# EAGLE design quadcopter_2 (EAGLE 8.1.1)
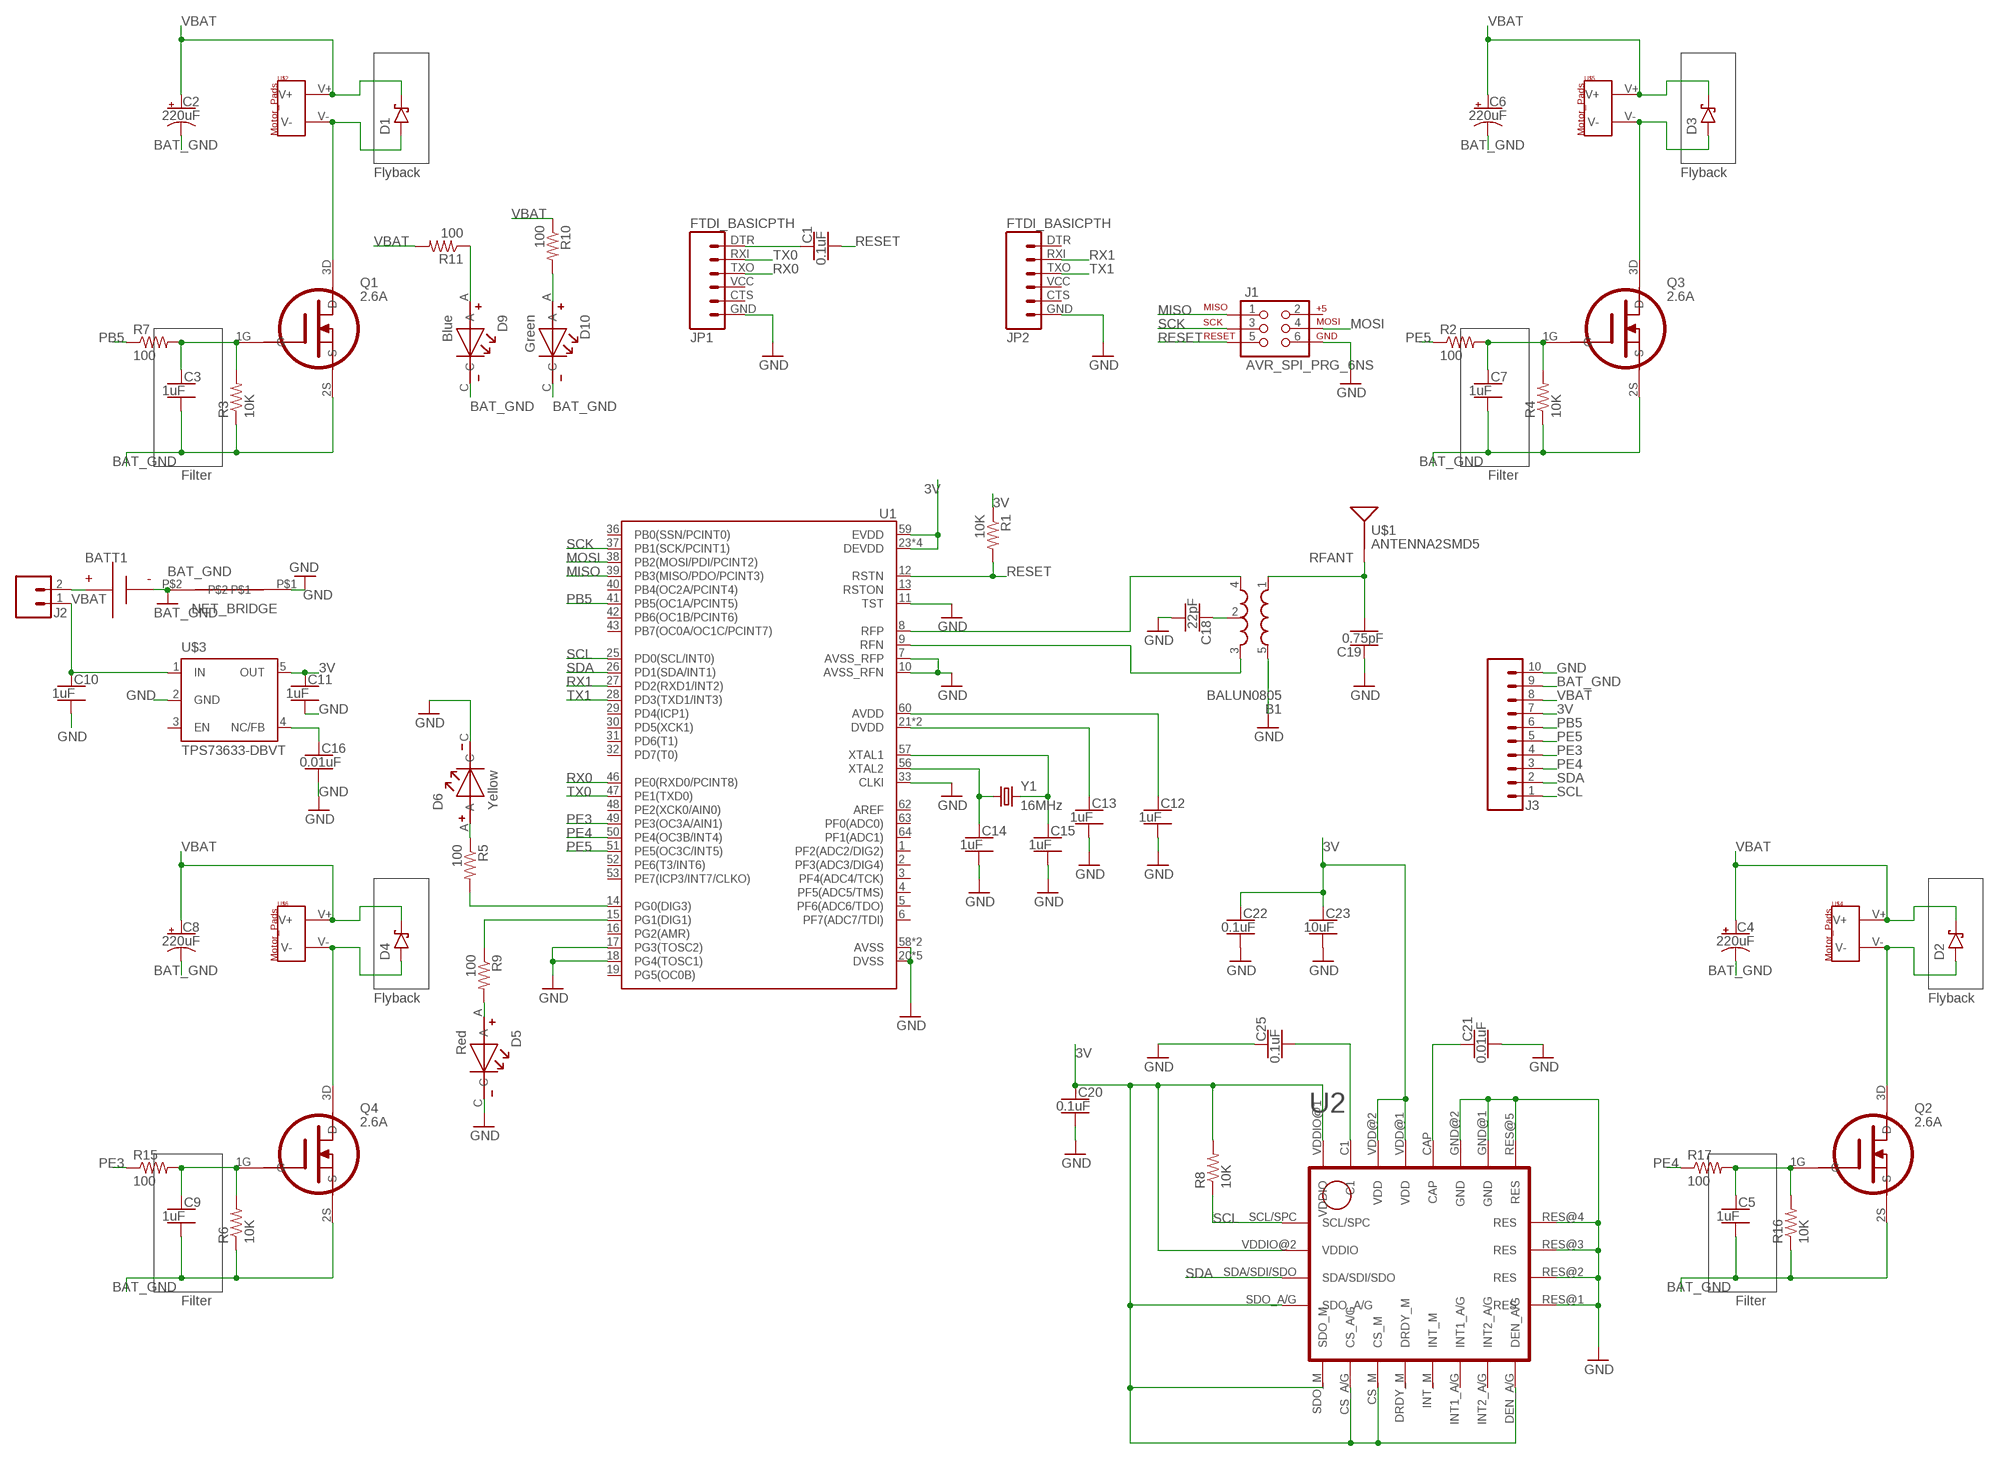
[diagram p0: schematic, sheet 1]

## Parts
B1  BALUN0805  [BALUN]
BATT1  BATTERY-HUBSAN-W/HOLDER  [BATTERY-W/HOLDER-380MAH-HUBSAN]
C1  0.1uF  CERAMIC_CAP-0805-0.1UF  [CERAMIC_CAP_0805]
C2  220uF  CAPACITOR-POL_SMD-7043-D_TANTALUM-220UF  [CAPMP7343X310_HS]
C3  1uF  CAPACITOR-NP_SMD-2012-0805_CERAMIC-1UF  [CAPC2012X140_HS]
C4  220uF  CAPACITOR-POL_SMD-7043-D_TANTALUM-220UF  [CAPMP7343X310_HS]
C5  1uF  CAPACITOR-NP_SMD-2012-0805_CERAMIC-1UF  [CAPC2012X140_HS]
C6  220uF  CAPACITOR-POL_SMD-7043-D_TANTALUM-220UF  [CAPMP7343X310_HS]
C7  1uF  CAPACITOR-NP_SMD-2012-0805_CERAMIC-1UF  [CAPC2012X140_HS]
C8  220uF  CAPACITOR-POL_SMD-7043-D_TANTALUM-220UF  [CAPMP7343X310_HS]
C9  1uF  CAPACITOR-NP_SMD-2012-0805_CERAMIC-1UF  [CAPC2012X140_HS]
C10  1uF  CAPACITOR-NP_SMD-2012-0805_CERAMIC-1UF  [CAPC2012X140_HS]
C11  1uF  CAPACITOR-NP_SMD-2012-0805_CERAMIC-1UF  [CAPC2012X140_HS]
C12  1uF  CAPACITOR-NP_SMD-2012-0805_CERAMIC-1UF  [CAPC2012X140_HS]
C13  1uF  CAPACITOR-NP_SMD-2012-0805_CERAMIC-1UF  [CAPC2012X140_HS]
C14  1uF  CAPACITOR-NP_SMD-2012-0805_CERAMIC-1UF  [CAPC2012X140_HS]
C15  1uF  CAPACITOR-NP_SMD-2012-0805_CERAMIC-1UF  [CAPC2012X140_HS]
C16  0.01uF  CAPACITOR-NP_SMD-2012-0805_CERAMIC-0.01UF  [CAPC2012X140_HS]
C18  22pF  CAPACITOR-NP_SMD-2012-0805_CERAMIC-22PF  [CAPC2012X140_HS]
C19  0.75pF  CAPACITOR-NP_SMD-2012-0805_CERAMIC-0.75PF  [CAPC2012X140_HS]
C20  0.1uF  CAPACITOR-NP_SMD-2012-0805_CERAMIC-0.1UF  [CAPC2012X140_HS]
C21  0.01uF  CAPACITOR-NP_SMD-2012-0805_CERAMIC-0.01UF  [CAPC2012X140_HS]
C22  0.1uF  CAPACITOR-NP_SMD-2012-0805_CERAMIC-0.1UF  [CAPC2012X140_HS]
C23  10uF  CAPACITOR-NP_SMD-2012-0805_CERAMIC-10UF  [CAPC2012X140_HS]
C25  0.1uF  CAPACITOR-NP_SMD-2012-0805_CERAMIC-0.1UF  [CAPC2012X140_HS]
D1  DIODE-SCHOTTKY_SMD-SOD123  [SOD3716X135_HS]
D2  DIODE-SCHOTTKY_SMD-SOD123  [SOD3716X135_HS]
D3  DIODE-SCHOTTKY_SMD-SOD123  [SOD3716X135_HS]
D4  DIODE-SCHOTTKY_SMD-SOD123  [SOD3716X135_HS]
D5  Red  LED_VLMX51Z1AARED  [LED_VLMX51Z1AA]
D6  Yellow  LED_VLMX51Z1AAYELLOW  [LED_VLMX51Z1AA]
D9  Blue  LED_OVS5MXBCR4BLUE  [LED_OVS5MXBCR4]
D10  Green  LED_OVS5MXBCR4GREEN  [LED_OVS5MXBCR4]
J1  AVR_SPI_PRG_6NS  [2X3-NS]
J2  MALE_HEADER_2POS-2X1-0.1IN  [MALE_HEADER_2X1_0.1IN]
J3  SIP-10_TH-254X10  [HDRV10W63P254_10X1_2540X254H838_HS]
JP1  FTDI_BASICPTH  [FTDI_BASIC]
JP2  FTDI_BASICPTH  [FTDI_BASIC]
NET_BRIDGE  NET_BRIDGE  [NET_BRIDGE]
Q1  2.6A  N_MOSFET_SI2302CDS_T1_E3  [N_MOSFET_SI2302CDS_T1_E3]
Q2  2.6A  N_MOSFET_SI2302CDS_T1_E3  [N_MOSFET_SI2302CDS_T1_E3]
Q3  2.6A  N_MOSFET_SI2302CDS_T1_E3  [N_MOSFET_SI2302CDS_T1_E3]
Q4  2.6A  N_MOSFET_SI2302CDS_T1_E3  [N_MOSFET_SI2302CDS_T1_E3]
R1  10K  RESISTOR_SMD-2012-0805-10K  [RESC2012X60_HS]
R2  100  RESISTOR_SMD-2012-0805-100  [RESC2012X60_HS]
R3  10K  RESISTOR_SMD-2012-0805-10K  [RESC2012X60_HS]
R4  10K  RESISTOR_SMD-2012-0805-10K  [RESC2012X60_HS]
R5  100  RESISTOR_SMD-2012-0805-100  [RESC2012X60_HS]
R6  10K  RESISTOR_SMD-2012-0805-10K  [RESC2012X60_HS]
R7  100  RESISTOR_SMD-2012-0805-100  [RESC2012X60_HS]
R8  10K  RESISTOR_SMD-2012-0805-10K  [RESC2012X60_HS]
R9  100  RESISTOR_SMD-2012-0805-100  [RESC2012X60_HS]
R10  100  RESISTOR_SMD-2012-0805-100  [RESC2012X60_HS]
R11  100  RESISTOR_SMD-2012-0805-100  [RESC2012X60_HS]
R15  100  RESISTOR_SMD-2012-0805-100  [RESC2012X60_HS]
R16  10K  RESISTOR_SMD-2012-0805-10K  [RESC2012X60_HS]
R17  100  RESISTOR_SMD-2012-0805-100  [RESC2012X60_HS]
U1  ATMEGA128RFA1  [QFN-64]
U2  IMU_LSM9DS1TR  [IMU_LSM9DS1TR]
U$1  ANTENNA2SMD5  [ANTENNA-CHIP5]
U$2  MOTOR_PADS  [MOTOR_PADS]
U$3  TPS73633-DBVT  [SOT23-DBV]
U$4  MOTOR_PADS  [MOTOR_PADS]
U$5  MOTOR_PADS  [MOTOR_PADS]
U$6  MOTOR_PADS  [MOTOR_PADS]
Y1  16MHz  CRYSTAL5X3  [CRYSTAL-SMD-5X3]

## Nets
3V: C11.1 C20.1 C22.1 C23.1 J3.7 R1.1 R8.2 U1.23(DEVDD) U1.34(DEVDD) U1.44(DEVDD) U1.54(DEVDD) U1.59(EVDD) U2.CS_A/G U2.CS_M U2.DEN_A/G U2.SDO_A/G U2.SDO_M U2.VDD@1(VDD) U2.VDD@2(VDD) U2.VDDIO@1(VDDIO) U2.VDDIO@2(VDDIO) U$3.5(OUT)
BAT_GND [HIGHCURRENT]: BATT1.-(N) C2.2(-) C3.2 C4.2(-) C5.2 C6.2(-) C7.2 C8.2(-) C9.2 D9.C D10.C J3.9 NET_BRIDGE.P$2 Q1.2S(S) Q2.2S(S) Q3.2S(S) Q4.2S(S) R3.1 R4.1 R6.1 R16.1
FILTERED [HIGHCURRENT]: C9.1 Q4.1G(G) R6.2 R15.2
GND: B1.5(GND) C10.2 C11.2 C12.2 C13.2 C14.2 C15.2 C16.2 C18.2 C19.1 C20.2 C21.2 C22.2 C23.2 C25.1 D5.C D6.C J1.6 J3.10 JP1.GND JP2.GND NET_BRIDGE.P$1 U1.7(AVSS_RFP) U1.10(AVSS_RFN) U1.11(TST) U1.17(PG3(TOSC2)) U1.18(PG4(TOSC1)) U1.20(DVSS) U1.24(DVSS) U1.33(CLKI) U1.35(DVSS) U1.45(DVSS) U1.55(DVSS) U1.58(AVSS) U1.61(AVSS) U2.GND@1(GND) U2.GND@2(GND) U2.RES@1(RES) U2.RES@2(RES) U2.RES@3(RES) U2.RES@4(RES) U2.RES@5(RES) U$3.2(GND)
MISO: U1.39(PB3(MISO/PDO/PCINT3))
MOSI: U1.38(PB2(MOSI/PDI/PCINT2))
N$1: C1.1 JP1.DTR
N$2: JP1.TXO
N$3: JP1.RXI
N$4: C1.2
N$5: C15.1 U1.57(XTAL1) Y1.3
N$6: JP2.RXI
N$7: JP2.TXO
N$8: J1.1
N$9: J1.4
N$10: C12.1 U1.60(AVDD)
N$11: J1.3
N$12: J1.5
N$13: C13.1 U1.21(DVDD) U1.22(DVDD)
N$14: C14.1 U1.56(XTAL2) Y1.1
N$15: C25.2 U2.C1
N$16 [HIGHCURRENT]: D1.A Q1.3D(D) U$2.V-
N$17: C21.1 U2.CAP
N$18: D10.A R10.2
N$19: D5.A R9.2
N$20: R5.2 U1.14(PG0(DIG3))
N$21: B1.4(OUT1) U1.8(RFP)
N$22: B1.3(OUT2) U1.9(RFN)
N$23: BATT1.+(P) J2.2
N$24 [HIGHCURRENT]: D3.A Q3.3D(D) U$5.V-
N$25: B1.2(GND) C18.1
N$26: R9.1 U1.15(PG1(DIG1))
N$27: D9.A R11.1
N$28: D6.A R5.1
N$29 [HIGHCURRENT]: D4.A Q4.3D(D) U$6.V-
N$30 [HIGHCURRENT]: D2.A Q2.3D(D) U$4.V-
N$31 [HIGHCURRENT]: C7.1 Q3.1G(G) R2.2 R4.2
N$32: C16.1 U$3.4(NC/FB)
N$33 [HIGHCURRENT]: C3.1 Q1.1G(G) R3.2 R7.2
N$34 [HIGHCURRENT]: C5.1 Q2.1G(G) R16.2 R17.2
PB5: J3.6 R7.1 U1.41(PB5(OC1A/PCINT5))
PE3: J3.4 R15.1 U1.49(PE3(OC3A/AIN1))
PE4: J3.3 R17.1 U1.50(PE4(OC3B/INT4))
PE5: J3.5 R2.1 U1.51(PE5(OC3C/INT5))
RESET: R1.2 U1.12(RSTN)
RFANT [RFSIG]: B1.1(IN) C19.2 U$1.FEED(SIGNAL)
RX0: U1.46(PE0(RXD0/PCINT8))
RX1: U1.27(PD2(RXD1/INT2))
SCK: U1.37(PB1(SCK/PCINT1))
SCL: J3.1 R8.1 U1.25(PD0(SCL/INT0)) U2.SCL/SPC
SDA: J3.2 U1.26(PD1(SDA/INT1)) U2.SDA/SDI/SDO
TX0: U1.47(PE1(TXD0))
TX1: U1.28(PD3(TXD1/INT3))
VBAT [HIGHCURRENT]: C2.1(+) C4.1(+) C6.1(+) C8.1(+) C10.1 D1.C D2.C D3.C D4.C J2.1 J3.8 R10.1 R11.2 U$2.V+ U$3.1(IN) U$4.V+ U$5.V+ U$6.V+
Unconnected: J1.2 JP1.CTS JP1.VCC JP2.CTS JP2.DTR JP2.VCC U1.1(PF2(ADC2/DIG2)) U1.2(PF3(ADC3/DIG4)) U1.3(PF4(ADC4/TCK)) U1.4(PF5(ADC5/TMS)) U1.5(PF6(ADC6/TDO)) U1.6(PF7(ADC7/TDI)) U1.13(RSTON) U1.16(PG2(AMR)) U1.19(PG5(OC0B)) U1.29(PD4(ICP1)) U1.30(PD5(XCK1)) U1.31(PD6(T1)) U1.32(PD7(T0)) U1.36(PB0(SSN/PCINT0)) U1.40(PB4(OC2A/PCINT4)) U1.42(PB6(OC1B/PCINT6)) U1.43(PB7(OC0A/OC1C/PCINT7)) U1.48(PE2(XCK0/AIN0)) U1.52(PE6(T3/INT6)) U1.53(PE7(ICP3/INT7/CLKO)) U1.62(AREF) U1.63(PF0(ADC0)) U1.64(PF1(ADC1)) U2.DRDY_M U2.INT1_A/G U2.INT2_A/G U2.INT_M U$3.3(EN)

## Notes on the sheet
- Flyback | Flyback
- Filter | Filter
- Flyback | Flyback
- Filter | Filter

## Library data of the parts
B1 = quadparts_prebuilt:BALUN: 0805 footprint balun- Ember 351/357; DATASHEET: http://katalog.we-online.de/pbs/datasheet/748421245.pdf; DIST: Digikey; DISTPN: 732-2230-6-ND; MFR: Wurth Electronics Inc; MPN: 748421245; PRICE: 2.63
BATT1 = quadparts_prebuilt:BATTERY; CREATOR: Swanson; DIST: AMAZON; DISTPN: http://www.amazon.com/dp/B00RROB6Q4?smid=AMNTPWSAB5H0S; MFR: HUBSAN; MPN: X4-H107C-8-in-1
C1 = quadparts_connie:CERAMIC_CAP: Nonpolarized capacitor; CREATOR: SWANSON; DIST: Digikey; DISTPN: 490-1666-1-ND; MFR: Murata Electronics North America; MPN: GRM21BR71H104KA01L
C2 C4 C6 C8 = quadparts_prebuilt:CAPACITOR-POL_: Polarized capacitor; DIST: Digikey; DISTPN: 478-8912-1-ND; MFR: AVX Corporation; MPN: TAJD227K006RNJ
C3 C5 C7 C9-C15 = quadparts_prebuilt:CAPACITOR-NP_: Nonpolarized capacitor; DIST: Digikey; DISTPN: 490-4736-1-ND; MFR: Murata Electronics North America; MPN: GRM21BR71H105KA12L
C16 C21 = quadparts_prebuilt:CAPACITOR-NP_: Nonpolarized capacitor; DIST: Digikey; DISTPN: 490-8295-1-ND; MFR: Murata Electronics North America; MPN: GRM2195C1H103FA01D
C18 = quadparts_prebuilt:CAPACITOR-NP_: Nonpolarized capacitor; DIST: Digikey; DISTPN: 490-5534-1-ND; MFR: Murata Electronics North America; MPN: GRM21A5C2E220JW01D
C19 = quadparts_prebuilt:CAPACITOR-NP_: Nonpolarized capacitor; DIST: Digikey; DISTPN: 490-3585-1-ND; MFR: Murata Electronics North America; MPN: GQM2195C2AR75CB01D
C20 C22 C25 = quadparts_prebuilt:CAPACITOR-NP_: Nonpolarized capacitor; DIST: Digikey; DISTPN: 490-1666-1-ND; MFR: Murata Electronics North America; MPN: GRM21BR71H104KA01L
C23 = quadparts_prebuilt:CAPACITOR-NP_: Nonpolarized capacitor; DIST: Digikey; DISTPN: 490-5523-1-ND; MFR: Murata Electronics North America; MPN: GRM21BR61E106KA73L
D1-D4 = quadparts_prebuilt:DIODE-SCHOTTKY_: Schottky diode
D5 = LEDs:LED_VLMX51Z1AA: 2.2V, 140mA test, 200mA max; CREATOR: Jason Shiuan; DIST: Digikey; DISTPN: VLMR51Z1AA-GS08CT-ND; MFR: Vishay; MPN: VLMR51Z1AA-GS08
D6 = LEDs:LED_VLMX51Z1AA: 2.2V, 140mA test, 200mA max; CREATOR: Jason Shiuan; DIST: Digikey; DISTPN: VLMY51Z1AA-GS08CT-ND; MFR: Vishay; MPN: VLMY51Z1AA-GS08
D9 = LEDs:LED_OVS5MXBCR4: 3.4V, 150mA test, 180mA max; CREATOR: Jason Shiuan; DIST: Digikey; DISTPN: 365-1544-1-ND; MFR: TT Electronics/Optek Technology; MPN: OVS5MBBCR4
D10 = LEDs:LED_OVS5MXBCR4: 3.4V, 150mA test, 180mA max; CREATOR: Jason Shiuan; DIST: Digikey; DISTPN: 365-1545-1-ND; MFR: TT Electronics/Optek Technology; MPN: OVS5MGBCR4
J1 = quadparts_prebuilt:AVR_SPI_PRG_6: AVR ISP 6 Pin This is the reduced ISP connector for AVR programming. Common on Arduino. This footprint will take up less PCB space and can be used with a 10-pin to 6-pin adapter such as SKU: BOB-08508; DATASHEET: http://portal.fciconnect.com/Comergent//fci/drawing/67996.pdf; DIST: Digikey; DISTPN: 609-3234-ND; MFR: Amphenol FCI; MPN: 67997-206HLF; PRICE: 0.31
J2 = quadparts_connie:MALE_HEADER_2POS: 2 pin single inline pin header, socket, or connector; CREATOR: SWANSON; DIST: Digikey; DISTPN: 3M9447-ND; MFR: 3M; MPN: 961102-6404-AR
J3 = quadparts_prebuilt:SIP-10_: 10 pin single inline pin header, socket, or connector; DATASHEET: http://portal.fciconnect.com/Comergent//fci/drawing/68000.pdf; DIST: Digikey; DISTPN: 609-3250-ND; MFR: Amphenol FCI; MPN: 68000-110HLF; PRICE: 0.55
JP1 JP2 = quadparts_prebuilt:FTDI_BASIC: FTDI Basic header with labels; DATASHEET: http://portal.fciconnect.com/Comergent//fci/drawing/68015.pdf; DIST: Digikey; DISTPN: 609-3327-ND; MFR: Amphenol FCI; MPN: 68016-406HLF; PRICE: 0.33
NET_BRIDGE = quadparts_jason:NET_BRIDGE; CREATPR: Jason Shiuan
Q1-Q4 = quadparts_connie:N_MOSFET_SI2302CDS_T1_E3; CREATOR: Connie Du; DIST: Digikey; DISTPN: SI2302CDS-T1-E3CT-ND; MFR: Vishay Siliconix; MPN: SI2302CDS-T1-E3
R1 R3 R4 R6 R8 R16 = quadparts_prebuilt:RESISTOR_: Resistor; DIST: Digikey; DISTPN: 311-10KARCT-ND; MFR: Yageo; MPN: RC0805JR-0710KL
R2 R5 R7 R9-R11 R15 R17 = quadparts_prebuilt:RESISTOR_: Resistor; DIST: Digikey; DISTPN: 311-100ARCT-ND; MFR: Yageo; MPN: RC0805JR-07100RL
U1 = quadparts_prebuilt:ATMEGA128RFA1: ATmega128RFA1 8-bit AVR Microcontroller with Low Power 2.4GHz Transceiver for ZigBee and IEEE 802.15.4; CREATOR: Swanson; DATASHEET: http://www.atmel.com/Images/Atmel-8266-MCU_Wireless-ATmega128RFA1_Datasheet.pdf; DIST: Digikey; DISTPN: ATMEGA128RFA1-ZUR00DKR-ND; MFR: Atmel; MPN: ATMEGA128RFA1-ZUR00; PRICE: 10.21
U2 = quadparts_connie:IMU_LSM9DS1TR; CREATOR: Connie Du; DIST: Digikey; DISTPN: 497-14946-1-ND; MFR: STMicroelectronics; MPN: LSM9DS1TR
U$1 = quadparts_prebuilt:ANTENNA2: Chip antenna Single endded antenna. Common with smaller chip antennas. CHIP4 package is the GPS Chip Antenna SKU: GPS-08418. CHIP5 package is 2.4GHz chip antenna SKU: WRL-00144.; DATASHEET: http://www.linxtechnologies.com/resources/data-guides/ant-xxx-chp-x.pdf; DIST: Digikey; DISTPN: ANT-2.45-CHPCT-ND; MFR: Linx Technologies Inc.; MPN: ANT-2.45-CHP-T; PRICE: 3.16
U$2 U$4-U$6 = quadparts_prebuilt:MOTOR_PADS; DIST: NA; DISTPN: NA; MFR: NA; MPN: NA
U$3 = quadparts_prebuilt:TPS73633-DBVT; DATASHEET: http://www.ti.com/lit/ds/symlink/lp3985.pdf; DIST: Digikey; DISTPN: LP3985IM5X-3.0/NOPBCT-ND; MFR: Texas Instruments; MPN: LP3985IM5X-3.0/NOPB; PRICE: 0.59
Y1 = quadparts_prebuilt:CRYSTAL: Various standard crystals. Proven footprints.; DATASHEET: http://www.abracon.com/Resonators/abm3b.pdf; DIST: Digikey; DISTPN: 535-9122-1-ND; MFR: Abracon LLC; MPN: ABM3B-16.000MHZ-B2-T; PRICE: 0.68; PROD_ID: XTAL-08218

## Net classes
1 RFSIG: width 0.457 mm
2 HIGHCURRENT: width 0.457 mm

## Board
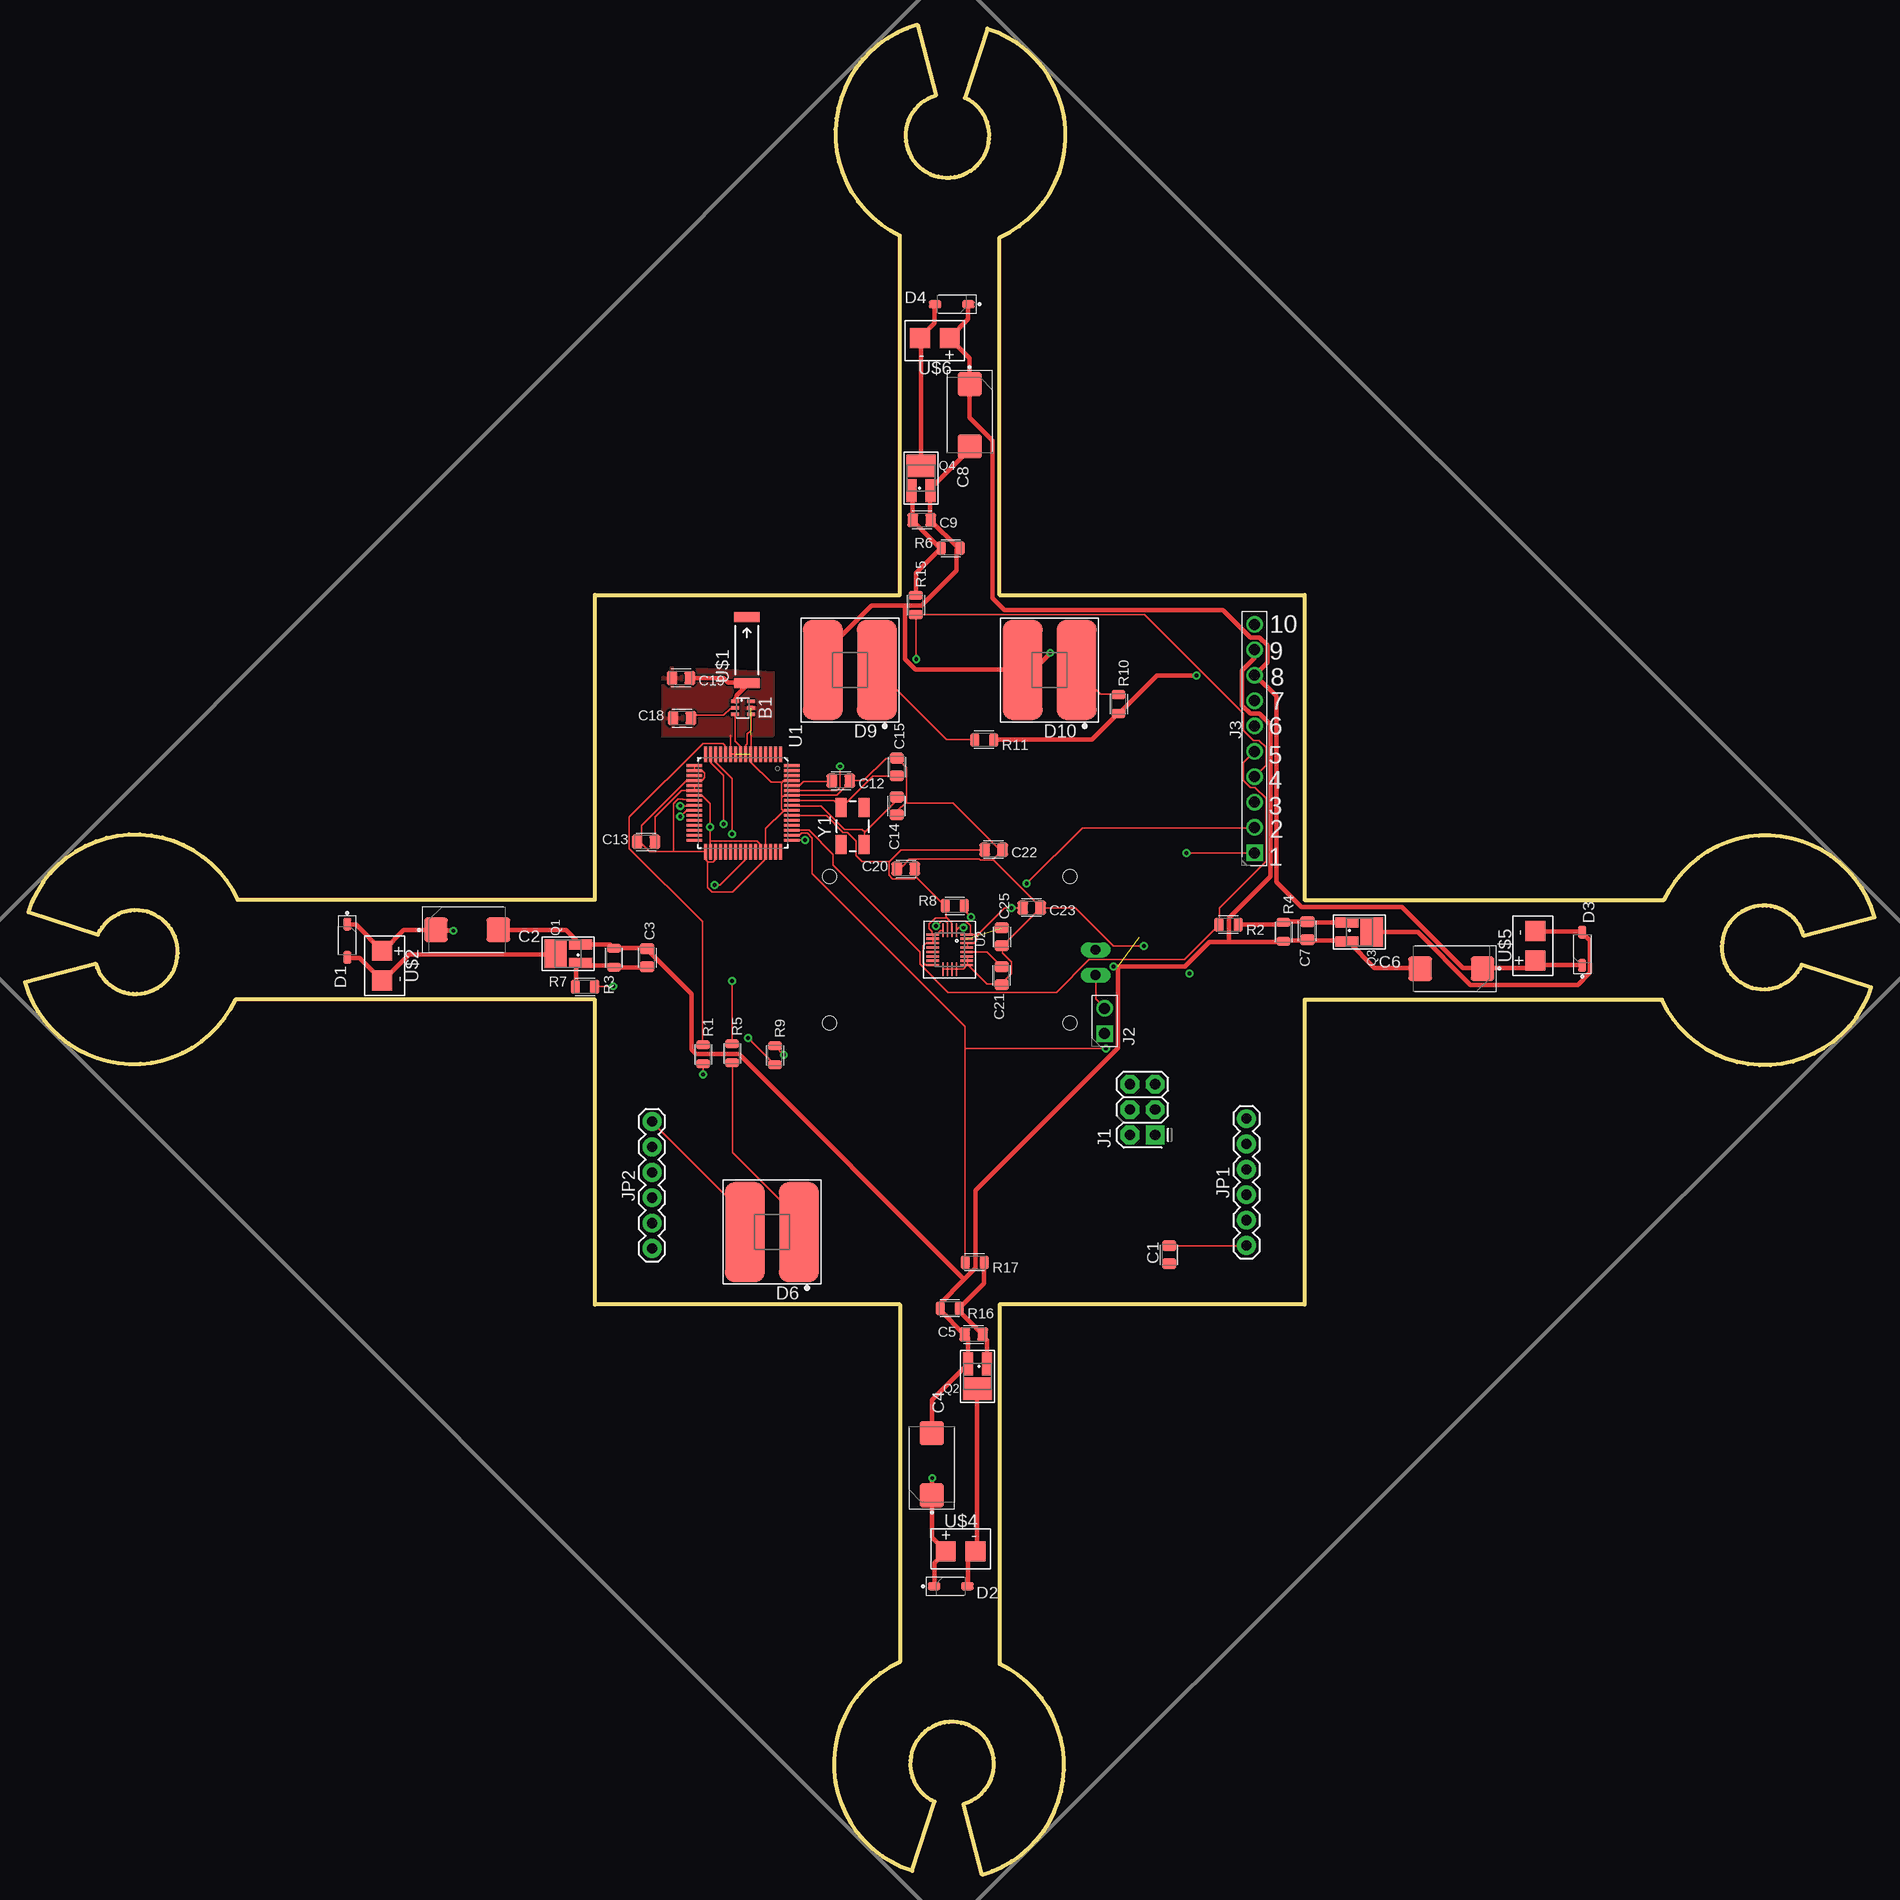
[diagram p1: board, top side]
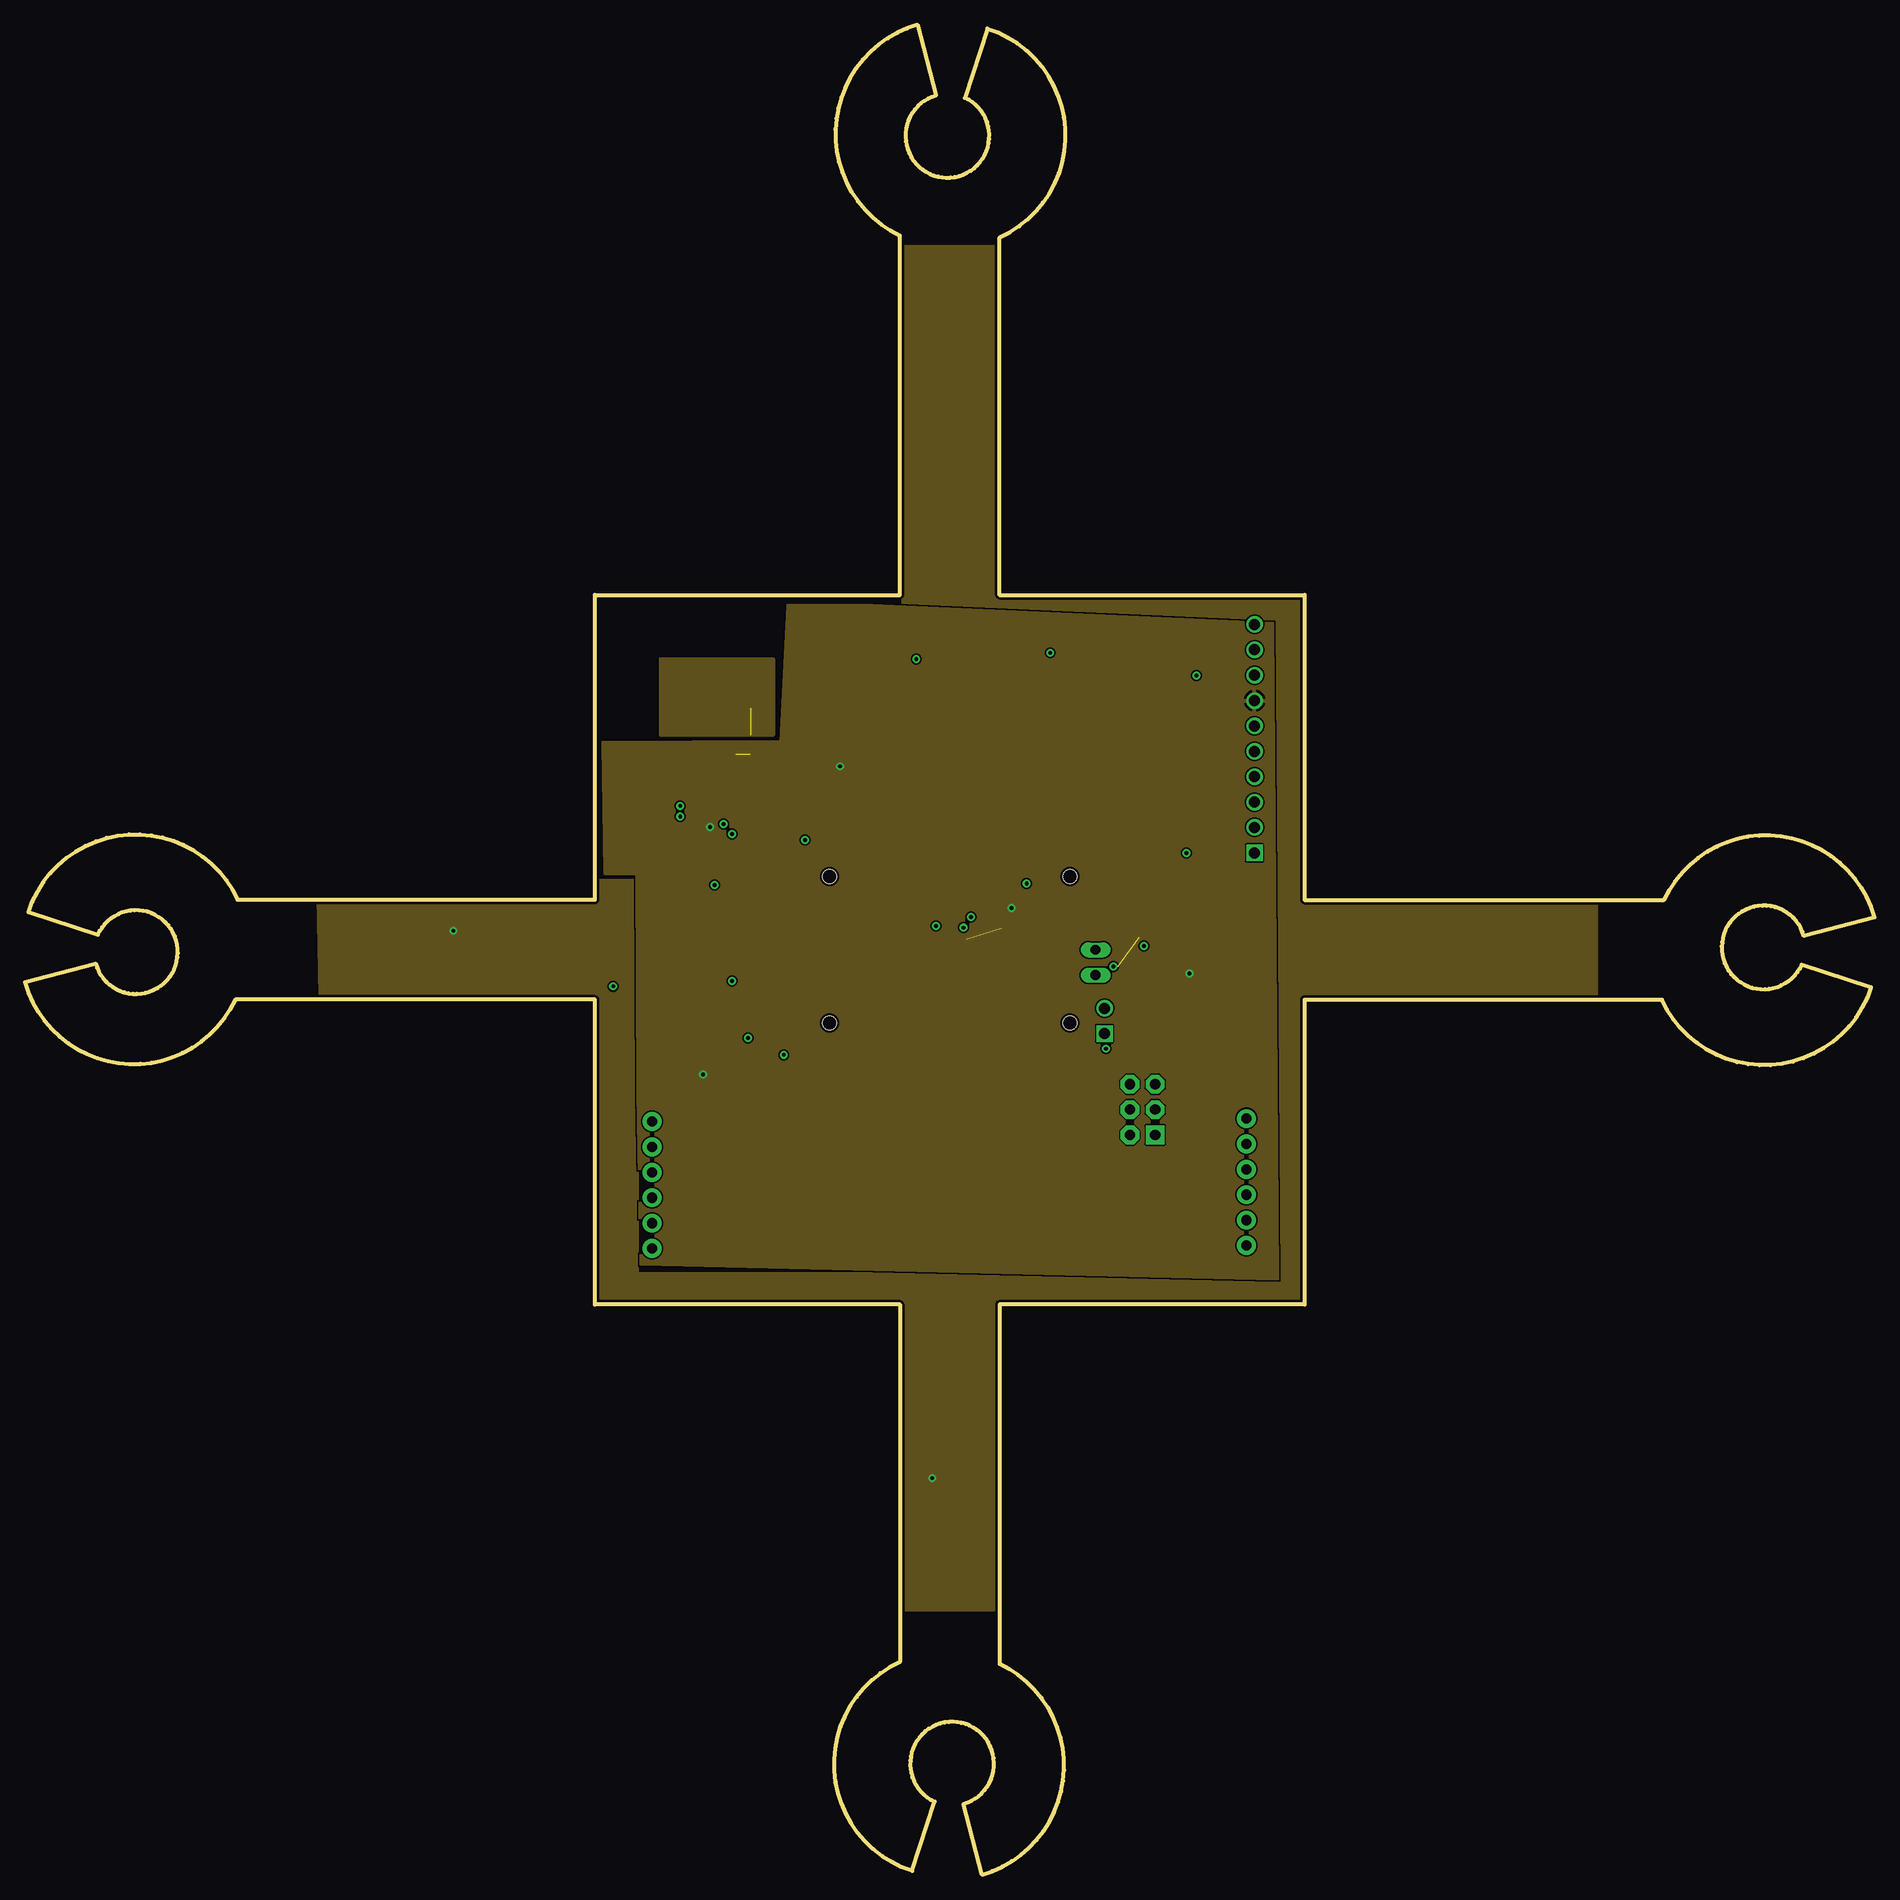
[diagram p2: board, inner layer Route2]
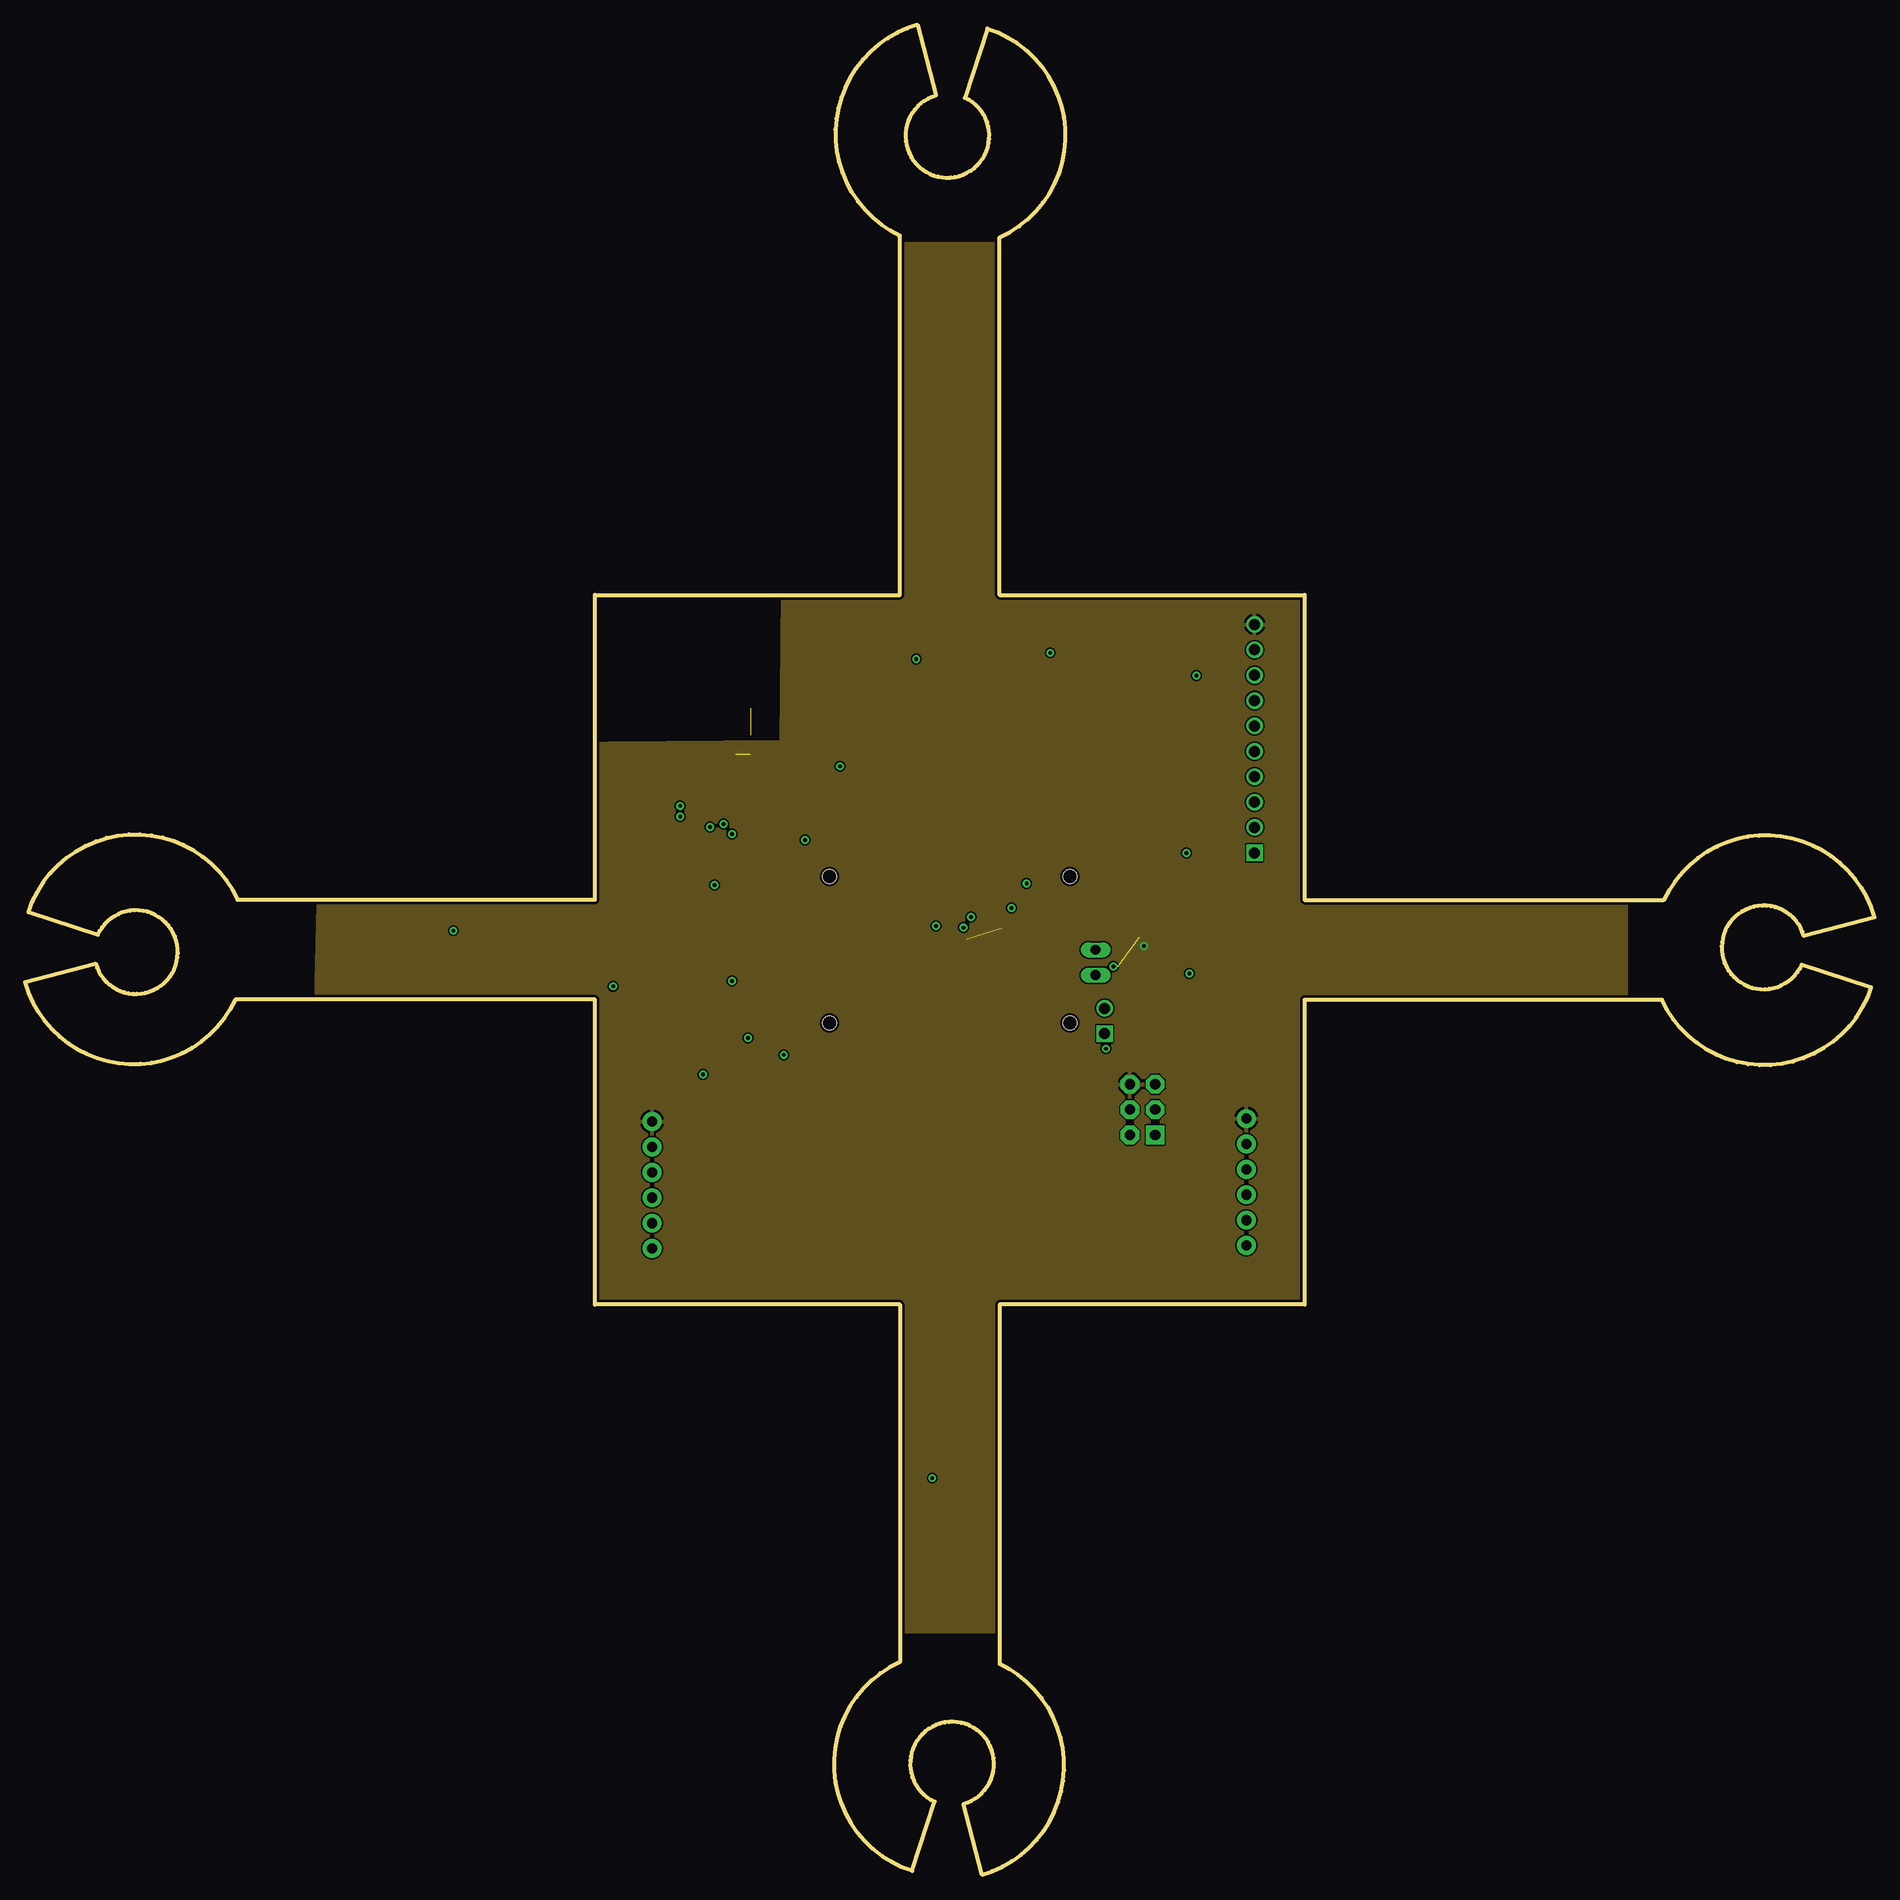
[diagram p3: board, inner layer Route15]
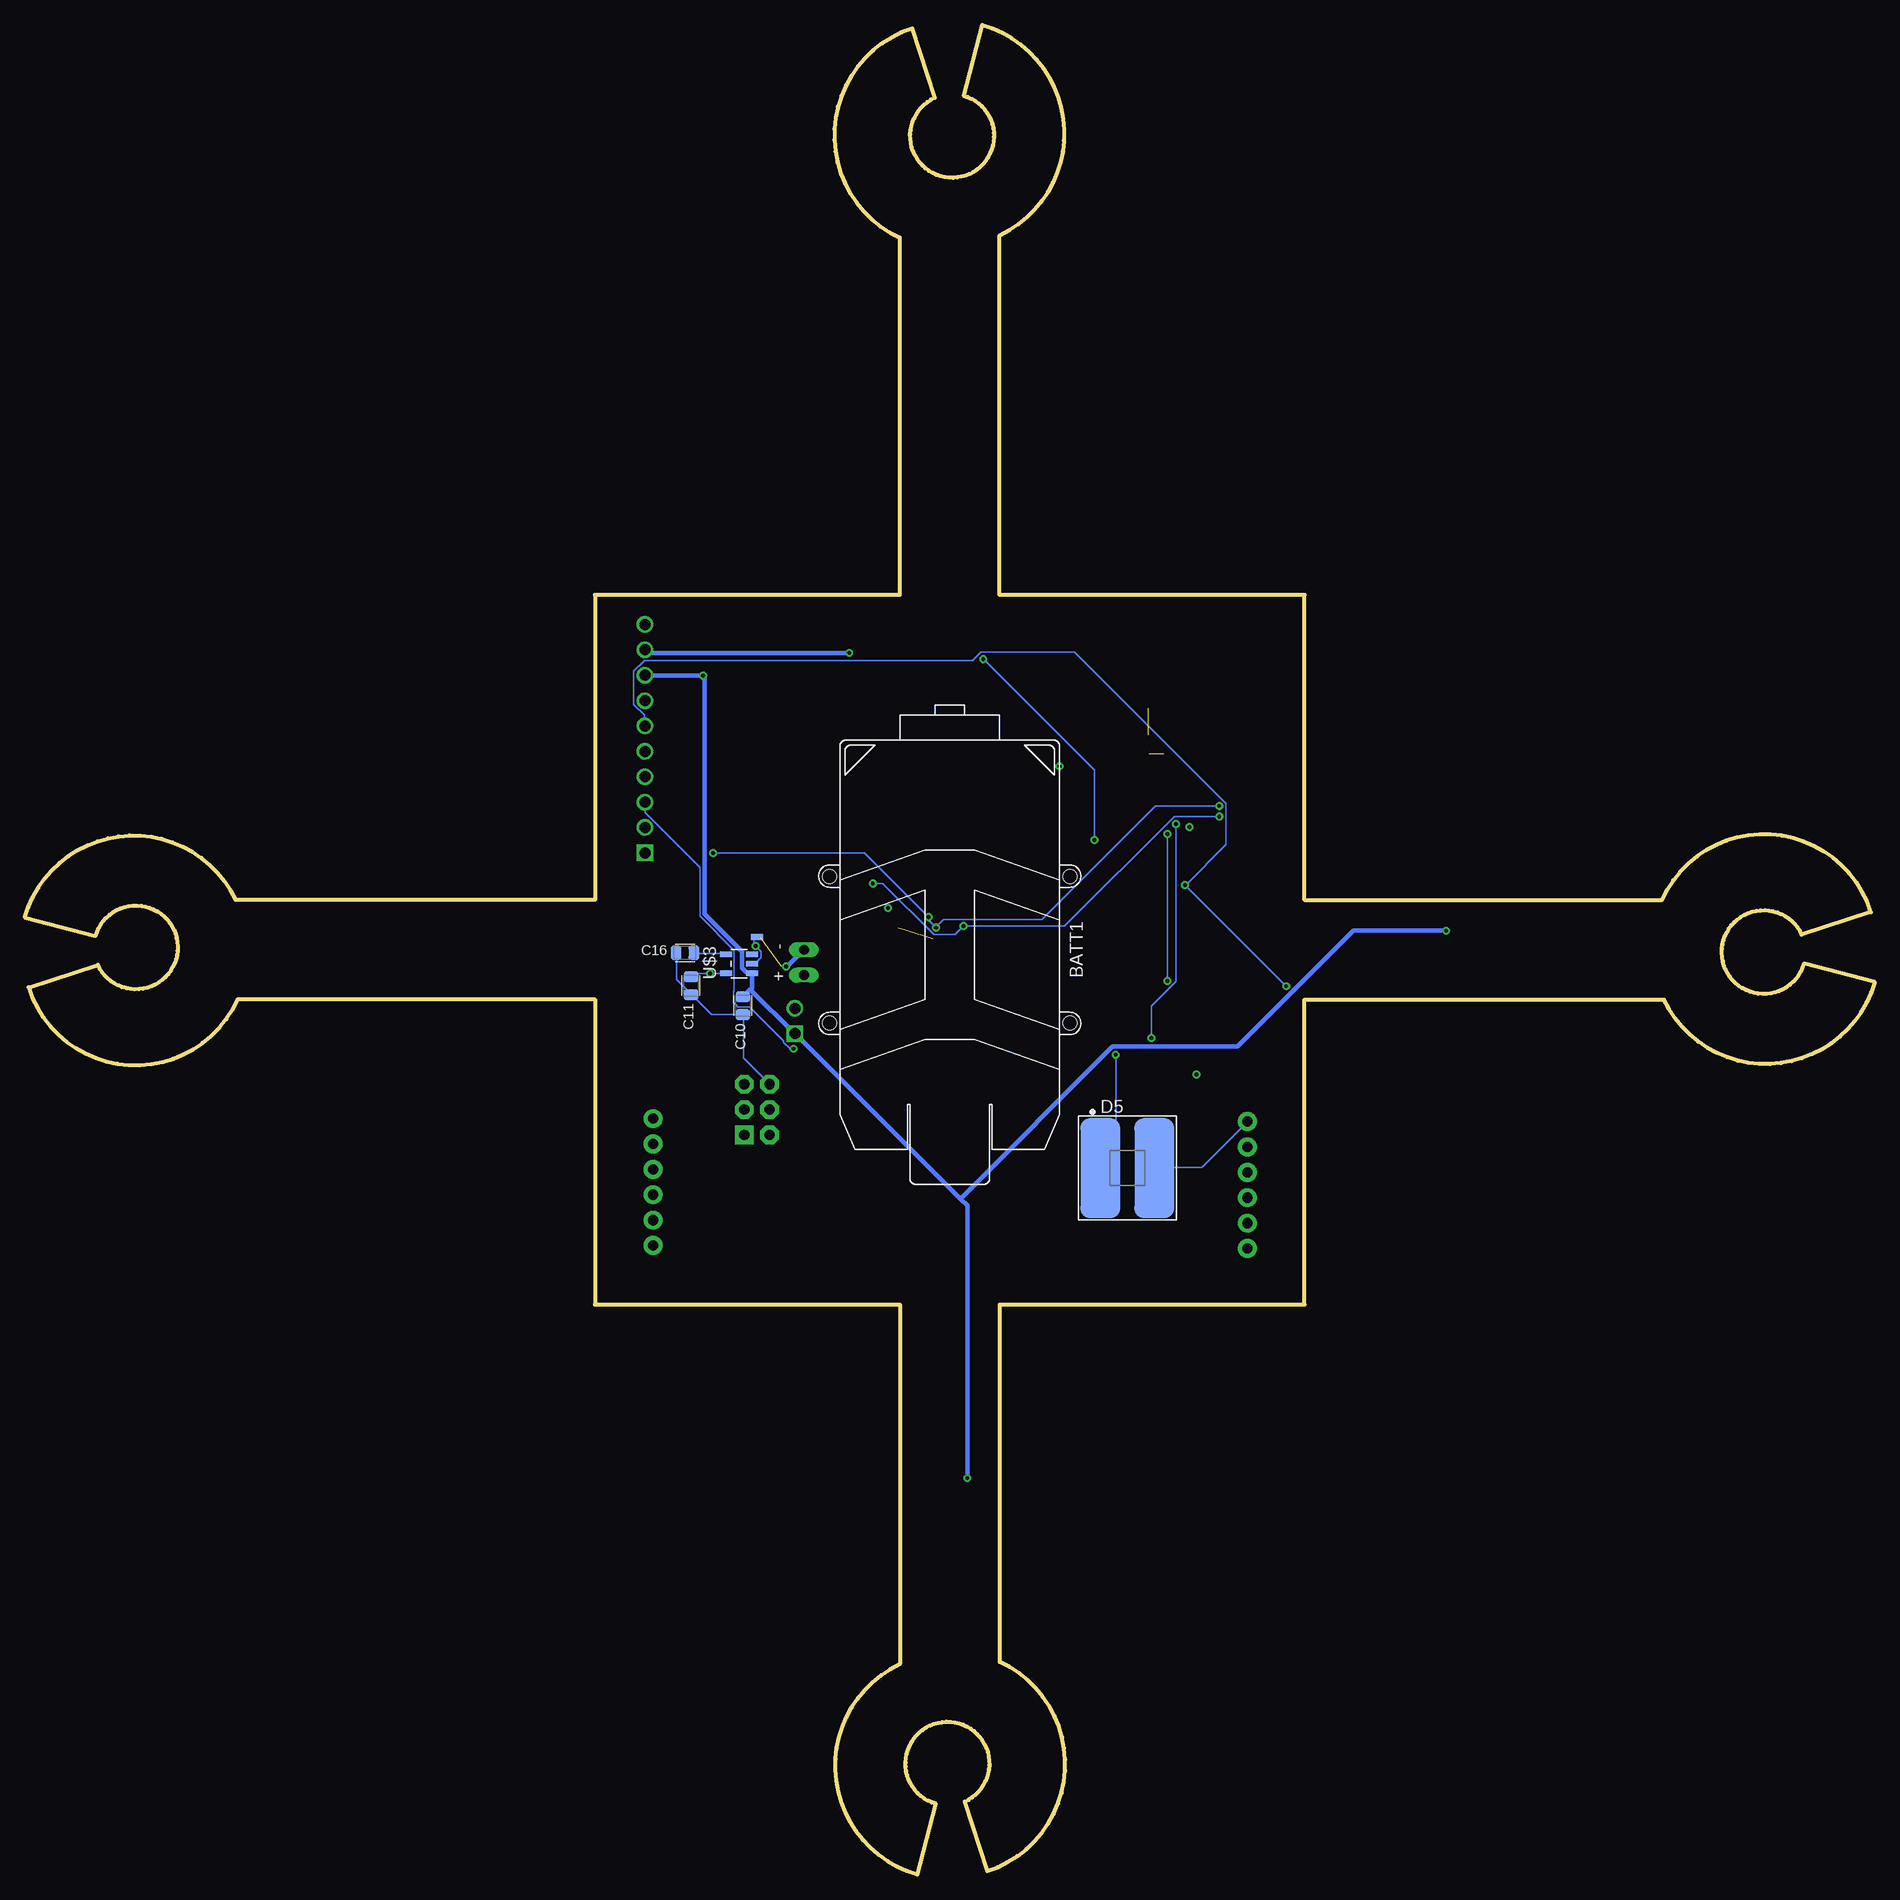
[diagram p4: board, bottom side, seen from below]

Size 185.12 x 185.12 mm. Coordinates in mm from the lower left corner, seen from the top.
Outline: 128.06,87.56 163.84,87.56 arc138 184.77,88.79 177.84,91.06 arc-319 178.05,93.95 185.12,95.79 arc139 164.05,97.56 128.06,97.56 128.06,128.06 97.56,128.06 97.56,163.84 arc138 96.33,184.77 94.07,177.84 arc-319 91.17,178.05 89.33,185.12 arc139 87.56,164.05 87.56,128.06 57.06,128.06 57.06,97.56 21.28,97.56 arc138 0.35,96.33 7.28,94.07 arc-319 7.07,91.17 0,89.33 arc139 21.07,87.56 57.06,87.56 57.06,57.06 87.56,57.06 87.56,21.28 arc138 88.79,0.35 91.06,7.28 arc-319 93.95,7.07 95.79,0 arc139 97.56,21.07 97.56,57.06 128.06,57.06 128.06,87.56
Copper layers (1*2*15*16): Top 0.035559375mm / dielectric 1.501140625mm / Route2 0.035559375mm / dielectric 0.149859375mm / Route15 0.035559375mm / dielectric 0.200659375mm / Bottom 0.035559375mm
Design rules "connie_jason_4pcb-33board": minimum track width 6mil, minimum drill 15mil, track to track 6mil, track to pad 6mil, pad to pad 6mil, via to via 6mil, smd to smd 6mil, copper to edge 10mil, drill to drill 10mil, minimum pad ring 10mil, minimum via ring 8mil, stop-mask expansion 4mil, vias tented up to drill 0mil, thermal gap 10mil
tRestrict: area 91.9,91.7 to 93.3,93.5; area 57.6,114.1 to 75.2,125.7; area 74.5,125.1 to 77,127.6; area 57.7,125.5 to 70,127.5
bRestrict: area 91.9,91.7 to 93.3,93.5; area 57.7,114 to 75.2,125.7; area 74.5,125.1 to 77.1,127.6; area 57.7,125.5 to 70,127.5

### Footprints (pad centres in the part's own frame; a part is rotated, then mirrored left to right if it is on the bottom)
BALUN = smd 0.35 x 0.8: 1 -0.65,-0.8; 2 0,-0.8; 3 0.65,-0.8; 4 0.65,0.8; 5 0,0.8; 6 -0.65,0.8
BATTERY-W/HOLDER-380MAH-HUBSAN = drill 1 long: + -2.54,14.605; - 0,14.605 | hole 1.4: -7.35,-12.05; -7.35,12.05; 7.35,-12.05; 7.35,12.05
CERAMIC_CAP_0805 = smd 1.08 x 1.42: 1 -0.895,0; 2 0.895,0
CAPMP7343X310_HS = smd 2.37 x 2.43: 1 -3.12,0; 2 3.12,0
CAPC2012X140_HS = smd 1.08 x 1.42: 1 -0.895,0; 2 0.895,0
SOD3716X135_HS = smd 1.25 x 0.8: A 1.665,0; C -1.665,0
LED_VLMX51Z1AA = smd 4 x 10: A -2.7,0; C 2.7,0
LED_OVS5MXBCR4 = smd 4 x 10: A -2.7,0; C 2.7,0
2X3-NS = drill 1.016 pad 1.88 square: 1 -2.54,-1.27 | drill 1.016 pad 1.88 octagon: 2 -2.54,1.27; 3 0,-1.27; 4 0,1.27; 5 2.54,-1.27; 6 2.54,1.27
MALE_HEADER_2X1_0.1IN = drill 1.1 pad 1.65 square: 1 0,0 | drill 1.1 pad 1.65: 2 2.54,0
HDRV10W63P254_10X1_2540X254H838_HS = drill 1.1 pad 1.65 square: 1 0,0 | drill 1.1 pad 1.65: 2 2.54,0; 3 5.08,0; 4 7.62,0; 5 10.16,0; 6 12.7,0; 7 15.24,0; 8 17.78,0; 9 20.32,0; 10 22.86,0
FTDI_BASIC = drill 1.016 pad 1.88: CTS 10.16,0; DTR 0,0; GND 12.7,0; RXI 2.54,0; TXO 5.08,0; VCC 7.62,0
NET_BRIDGE = smd 0.6 x 0.6: P$1 -0.3,0; P$2 0.3,0
N_MOSFET_SI2302CDS_T1_E3 = smd 1 x 2.3: 1G -0.95,-1.25; 2S 0.95,-1.25 | smd 2.9 x 2.25: 3D 0,1.25
RESC2012X60_HS = smd 0.92 x 1.38: 1 -0.955,0; 2 0.955,0
QFN-64 = smd 1.562 x 0.28: 1 -4.881,3.75; 2 -4.881,3.25; 3 -4.881,2.75; 4 -4.881,2.25; 5 -4.881,1.75; 6 -4.881,1.25; 7 -4.881,0.75; 8 -4.881,0.25; 9 -4.881,-0.25; 10 -4.881,-0.75; 11 -4.881,-1.25; 12 -4.881,-1.75; 13 -4.881,-2.25; 14 -4.881,-2.75; 15 -4.881,-3.25; 16 -4.881,-3.75; 33 4.881,-3.75; 34 4.881,-3.25; 35 4.881,-2.75; 36 4.881,-2.25; 37 4.881,-1.75; 38 4.881,-1.25; 39 4.881,-0.75; 40 4.881,-0.25; 41 4.881,0.25; 42 4.881,0.75; 43 4.881,1.25; 44 4.881,1.75; 45 4.881,2.25; 46 4.881,2.75; 47 4.881,3.25; 48 4.881,3.75 | smd 0.28 x 1.562: 17 -3.75,-4.881; 18 -3.25,-4.881; 19 -2.75,-4.881; 20 -2.25,-4.881; 21 -1.75,-4.881; 22 -1.25,-4.881; 23 -0.75,-4.881; 24 -0.25,-4.881; 25 0.25,-4.881; 26 0.75,-4.881; 27 1.25,-4.881; 28 1.75,-4.881; 29 2.25,-4.881; 30 2.75,-4.881; 31 3.25,-4.881; 32 3.75,-4.881; 49 3.75,4.881; 50 3.25,4.881; 51 2.75,4.881; 52 2.25,4.881; 53 1.75,4.881; 54 1.25,4.881; 55 0.75,4.881; 56 0.25,4.881; 57 -0.25,4.881; 58 -0.75,4.881; 59 -1.25,4.881; 60 -1.75,4.881; 61 -2.25,4.881; 62 -2.75,4.881; 63 -3.25,4.881; 64 -3.75,4.881
IMU_LSM9DS1TR = smd 0.23 x 1.4: C1 -1.1,1.7; CAP 0.22,1.7; CS_A/G -1.1,-1.7; CS_M -0.66,-1.7; DEN_A/G 1.54,-1.7; DRDY_M -0.22,-1.7; GND@1 1.1,1.7; GND@2 0.66,1.7; INT1_A/G 0.66,-1.7; INT2_A/G 1.1,-1.7; INT_M 0.22,-1.7; RES@5 1.54,1.7; SDO_M -1.54,-1.7; VDD@1 -0.22,1.7; VDD@2 -0.66,1.7; VDDIO@1 -1.54,1.7 | smd 1.4 x 0.23: RES@1 1.95,-0.67; RES@2 1.95,-0.223; RES@3 1.95,0.223; RES@4 1.95,0.67; SCL/SPC -1.95,0.67; SDA/SDI/SDO -1.95,-0.223; SDO_A/G -1.95,-0.67; VDDIO@2 -1.95,0.223
ANTENNA-CHIP5 = smd 1.016 x 2.54: FEED -3.302,0; NC 3.302,0
MOTOR_PADS = smd 2 x 2: V+ -1,0; V- 2,0
SOT23-DBV = smd 0.55 x 1.2: 1 -0.95,-1.3; 2 0,-1.3; 3 0.95,-1.3; 4 0.95,1.3; 5 -0.95,1.3
CRYSTAL-SMD-5X3 = smd 1.9 x 1.1: 1 -1.85,-1.15; 2 1.85,-1.15; 3 1.85,1.15; 4 -1.85,1.15

### Placement (x,y rotation side)
B1  71.86,116.76 270 top
BATT1  92.56,92.56 90 bottom
C1  114.53,62.04 270 top
C2  44.26,94.56 0 top
C3  62.26,91.76 90 top
C4  90.76,41.06 90 top
C5  94.96,54.06 180 top
C6  142.76,90.66 180 top
C7  128.36,94.46 270 top
C8  94.56,146.06 270 top
C9  89.76,135.56 0 top
C10  113.26,86.96 270 bottom
C11  118.46,88.96 270 bottom
C12  81.66,109.46 0 top
C13  62.16,103.36 180 top
C14  87.26,106.96 270 top
C15  87.26,110.86 90 top
C16  119.06,92.26 180 bottom
C18  65.76,115.76 180 top
C19  65.66,119.76 0 top
C20  88.16,100.66 180 top
C21  97.76,89.96 270 top
C22  96.96,102.56 0 top
C23  100.76,96.76 0 top
C25  97.76,93.86 90 top
D1  32.26,93.46 270 top
D2  92.66,28.86 0 top
D3  155.86,92.66 90 top
D4  92.76,157.16 180 top
D5  74.79,70.71 0 bottom
D6  74.76,64.31 180 top
D9  82.56,120.56 180 top
D10  102.56,120.56 180 top
J1  111.86,76.56 90 top
J2  108.06,84.16 90 top
J3  123.06,102.26 90 top
JP1  122.26,62.96 90 top
JP2  62.76,62.66 90 top
NET_BRIDGE  111.86,93.86 0 bottom
Q1  54.36,92.16 90 top
Q2  95.36,49.86 180 top
Q3  133.56,94.36 270 top
Q4  89.66,139.76 0 top
R1  67.87,82.1 90 top
R2  120.46,95.06 0 top
R3  58.96,91.76 270 top
R4  125.96,94.36 90 top
R5  70.77,82.2 90 top
R6  92.66,132.76 180 top
R7  56.06,88.86 180 top
R8  93.06,96.96 180 top
R9  75.06,82 90 top
R10  109.46,117.15 90 top
R11  96,113.56 0 top
R15  89.16,127.06 90 top
R16  92.56,56.66 0 top
R17  95.06,61.26 0 top
U1  71.86,107.26 270 top
U2  92.56,92.56 270 top
U$1  72.26,122.56 90 top
U$2  35.76,91.46 270 top
U$3  113.66,91.16 90 bottom
U$4  93.16,32.36 0 top
U$5  151.16,92.46 90 top
U$6  91.56,153.76 180 top
Y1  82.85,104.92 90 top

### Tracks (layer width: path | path; a pad name or v marks a point on that pad's centre or on a via)
3V  (via drill 0.38)
  Top 0.152: U2.VDD@1 94.31,92.79 94.31,93.17 U2.VDD@2 94.39,93.17 94.92,93.17 95.23,93.47 95.23,93.86 95.19,93.89 | 94.62,94.08 95,94.08 95.19,93.89 | 94.62,94.08 94.31,94.08 U2.VDDIO@1 94.62,94.08 | 95.19,93.89 98.05,96.75 v98.73,96.75 99.8,96.75 C23.1 | U2.SDO_M 90.88,94.08 90.88,93.7 U2.CS_A/G 90.88,93.63 90.88,93.25 U2.CS_M 90.81,93.17 90.12,93.17 89.89,92.94 89.89,91.27 90.12,91.04 90.81,91.04 U2.DEN_A/G | U2.SDO_A/G 91.87,94.47 91.65,94.47 91.27,94.08 90.96,94.08 U2.SDO_M | 92.6,95.42 92.71,95.3 92.71,94.54 U2.VDDIO@2 | 92.6,95.42 92.22,95.8 | 92.22,95.8 92.18,95.84 92.18,96.9 R8.2 92.03,96.98 89.17,99.84 | 89.17,99.84 89.13,99.88 89.13,100.64 C20.1 | 86.5,101.36 86.46,101.32 86.46,100.03 86.85,99.65 88.98,99.65 89.17,99.84 | 86.5,101.36 87.68,102.54 95.99,102.54 C22.1 | U1.54 76.79,105.97 80.22,105.97 81.89,104.3 82.35,104.3 83.19,103.46 83.19,102.01 83.8,101.4 86.46,101.4 86.5,101.36 | U2.SDO_M 90.81,94.16 90.81,94.39 90.5,94.69 90.5,95.15 91.11,95.76 92.18,95.76 92.22,95.8 | 94.62,94.08 94.62,95 94.16,95.46 92.64,95.46 92.6,95.42 | 68.56,103.46 68.56,102.39 U1.34 | 68.56,103.46 v68.56,104.83 68.56,107.19 67.8,107.95 67.03,107.95 U1.23 | 68.56,103.46 73.28,103.46 73.59,103.15 73.59,102.39 U1.44 | v67.87,80.06 R1.1 | v81.59,110.92 81.59,108.79 81.28,108.49 76.79,108.49 U1.59
  Bottom 0.152: U$3.5 114.96,90.2 v116.56,90.2 118.09,90.2 118.39,89.89 C11.1
  pour Route2: 124.86,125.16 84.76,126.96 76.36,126.96 75.66,113.36 57.86,113.26 58.06,100.26 61.26,100.26 61.36,78.26 61.66,61.16 125.36,59.66
BAT_GND  (via drill 0.38)  (1 unrouted)
  Top 0.457: C8.2 94.54,142.93 94.54,142.62 90.66,138.74 Q4.2S 90.58,138.51 90.58,135.77 C9.2 90.66,135.54 93.4,132.79 93.55,132.79 R6.1 93.25,132.64 93.25,130.51 89.74,127 88.06,127 | 88.06,127 84.71,127 79.91,122.2 79.91,120.6 D9.C | 88.06,127 88.06,121.67 89.13,120.6 99.8,120.6 D10.C 100.03,120.68 101.02,120.68 v102.62,122.28 | C2.2 47.45,94.54 54.16,94.54 55.45,93.25 Q1.2S 55.68,93.09 58.58,93.09 58.8,92.87 R3.1 59.03,92.71 62.23,92.71 C3.2 62.39,92.48 66.73,88.14 66.73,82.58 67.19,82.12 71.45,82.12 94.01,59.57 | C4.2 90.81,44.25 90.81,47.53 94.24,50.96 Q2.2S 94.39,51.18 94.39,53.77 94.24,53.93 C5.2 94.01,54.08 91.65,56.44 91.65,56.59 R16.1 91.57,56.9 91.57,57.13 94.01,59.57 | C6.2 139.58,90.73 135.08,90.73 132.49,93.32 Q3.2S 132.26,93.47 128.53,93.47 C7.2 128.3,93.55 128.22,93.47 126.01,93.47 R4.1 125.78,93.32 120.53,93.32 | 109.4,90.88 116.11,90.88 118.54,93.32 120.53,93.32 | 109.4,90.88 v108.94,90.88 | 120.53,93.32 120.53,95.76 124.64,99.88 124.64,115.12 123.57,116.18 122.66,116.18 121.82,117.02 121.82,120.53 123.04,121.75 123.04,122.51 J3.9 | 94.01,59.57 95.15,60.71 95.15,68.48 109.4,82.73 109.4,90.88
  Bottom 0.457: v108.94,90.88 108.87,90.88 107.19,92.56 BATT1.- | v102.62,122.28 122.81,122.28 123.04,122.51 J3.9
FILTERED
  Top 0.457: Q4.1G 88.75,138.51 88.83,138.43 88.83,135.61 C9.1 88.98,135.38 91.49,132.87 R6.2 91.65,132.72 89.21,130.28 89.21,128.07 R15.2
GND  (via drill 0.38)  (2 unrouted)
  Top 0.152: U1.17 67.03,111 67.03,110.54 U1.18 67.03,110.47 67.8,110.47 68.02,110.24 68.02,109.78 67.8,109.55 67.03,109.55 U1.20 66.96,109.48 66.2,109.48 61.7,104.98 61.7,103.3 C13.2 61.32,103.3 61.62,103.3 62.54,102.39 64.9,102.39 | 64.9,102.39 U1.33 68.18,102.31 68.18,101.55 68.37,101.36 | 68.37,101.36 68.41,101.32 68.86,101.32 69.09,101.55 69.09,102.31 U1.35 | 64.9,102.39 64.9,107.19 65.36,107.65 65.81,107.65 65.89,107.57 66.96,107.57 U1.24 | 88.18,107.31 88.22,107.34 88.22,110.77 87.3,111.69 C15.2 87.23,111.69 86.16,111.69 83.95,109.48 82.58,109.48 C12.2 82.5,109.4 82.5,109.25 81.28,108.03 76.79,108.03 U1.58 76.71,107.95 75.87,107.95 75.76,107.84 | 88.18,107.31 87.3,106.43 87.3,106.12 C14.2 | U1.10 71.07,112.14 U1.11 70.61,112.22 70.61,114.06 | 72.67,114.06 72.67,112.14 U1.7 72.67,112.07 72.67,111.31 74.65,109.32 75.72,109.32 75.76,109.29 | 75.91,106.47 75.95,106.51 76.71,106.51 U1.55 | 75.91,106.47 74.12,104.68 U1.45 74.04,102.31 74.04,101.55 70.84,98.35 68.79,98.35 68.33,98.81 68.33,101.32 68.37,101.36 | 75.76,107.84 75.72,107.8 75.72,106.66 75.91,106.47 | 75.76,109.29 75.72,109.25 75.72,107.88 75.76,107.84 | 75.76,109.29 75.95,109.48 76.71,109.48 U1.61 | 96.87,101.59 97.82,102.54 C22.2 97.67,102.47 92.87,107.27 88.22,107.27 88.18,107.31 | 96.87,101.59 96.83,101.55 95.61,101.55 95.53,101.63 88.52,101.63 87.61,100.71 87.3,100.71 C20.2 | U2.RES@1 91.95,90.66 92.33,90.66 U2.RES@2 92.41,90.66 92.71,90.66 U2.RES@3 92.79,90.66 93.17,90.66 U2.RES@4 93.25,90.66 93.93,90.66 94.24,90.96 U2.RES@5 | U2.RES@5 94.31,91.04 94.31,91.42 U2.GND@1 94.31,91.49 94.31,91.87 U2.GND@2
  Top 0.152: U2.RES@5 94.39,91.04 96.29,89.13 97.74,89.13 C21.2 97.74,89.21 98.73,90.2 98.73,91.34 97.82,92.26 97.82,92.94 | 97.82,92.94 101.63,96.75 C23.2 | 97.82,92.94 C25.1 | v111.99,92.94 108.94,92.94 105.13,96.75 101.7,96.75 C23.2 | 96.87,101.59 101.63,96.83 C23.2 | D6.C 71.99,64.37 71.99,66.12 62.77,75.34 JP2.GND
  Bottom 0.152: C16.2 119.92,92.26 119.92,89.59 118.47,88.14 C11.2 118.39,88.06 116.41,86.08 113.29,86.08 C10.2 113.21,86.01 113.21,81.74 110.62,79.15 J1.6 | NET_BRIDGE.P$1 112.14,93.86 112.14,93.09 v111.99,92.94 111.46,92.41 111.46,91.8 112.07,91.19 112.3,91.19 U$3.2 | D5.C 72.06,70.77 67.34,70.77 62.77,75.34 JP2.GND
  pour Route15: 29.76,112.96 28.96,81.26 54.96,81.26 54.96,53.96 85.86,53.96 85.86,24.36 100.16,24.36 100.16,54.16 131.26,54.16 131.26,84.86 160.26,84.86 160.26,100.56 130.46,100.56 130.46,130.46 100.06,130.46 100.06,163.16 76.16,163.16 75.66,113.36
  pour Route2: 63.66,121.66 74.86,121.66 74.86,114.06 63.66,114.06
  pour Top: 74.86,121.66 63.66,121.66 63.66,114.06 74.86,114.06
N$1
  Top 0.152: C1.1 114.58,62.92 122.2,62.92 JP1.DTR
N$5
  Top 0.152: C15.1 87.23,109.93 84.86,109.93 81.74,106.81 Y1.3 81.66,106.81 80.98,107.5 76.79,107.5 U1.57
N$10
  Top 0.152: C12.1 80.75,109.4 77.93,109.4 77.55,109.02 76.79,109.02 U1.60
N$13
  Top 0.152: C13.1 63.07,103.38 63.07,105.82 65.74,108.49 66.96,108.49 U1.22 67.03,108.56 67.03,108.94 U1.21
N$14
  Top 0.152: 84.06,104.33 84.03,104.3 84.03,103.08 Y1.1 | 84.06,104.33 87.23,107.5 87.23,107.8 C14.1 | 84.06,104.33 83.8,104.6 82.04,104.6 79.68,106.96 76.79,106.96 U1.56
N$15  (1 unrouted)
N$16
  Top 0.457: D1.A 32.29,91.72 33.51,91.72 35.72,89.51 U$2.V- 35.94,89.59 38.46,92.1 53.09,92.1 Q1.3D
N$17
  Top 0.152: U2.CAP 94.31,92.33 96.29,92.33 97.74,90.88 C21.1
N$18
  Top 0.152: R10.2 109.4,118.16 107.65,118.16 105.29,120.53 D10.A
N$19  (via drill 0.38)
  Top 0.152: v75.95,82.04 75.11,82.88 R9.2
  Bottom 0.152: v75.95,82.04 75.95,72.29 77.47,70.77 D5.A
N$20  (via drill 0.38)
  Top 0.152: v70.77,89.44 70.77,83.19 R5.2 | v70.77,104.14 70.77,109.71 69.17,111.31 69.17,112.07 U1.14
  Bottom 0.152: v70.77,104.14 v70.77,89.44
N$21
  Top 0.152: B1.4 72.67,116.11 72.67,114.51 72.29,114.13 72.29,113.13 72.14,112.98 72.14,112.14 U1.8
N$22
  Top 0.152: B1.3 71.07,116.11 71.07,113.44 71.61,112.91 U1.9
N$23
  Top 0.152: BATT1.+ 107.19,89.97 107.19,87.61 108.03,86.77 J2.2
N$24
  Top 0.457: U$5.V- 151.23,94.39 155.81,94.39 D3.A 155.96,94.16 156.64,93.47 156.64,90.27 155.43,89.06 144.68,89.06 139.42,94.31 134.85,94.31 Q3.3D
N$25
  Top 0.152: B1.2 71,116.72 70.61,116.72 69.93,116.03 66.96,116.03 66.73,115.8 C18.1
N$26  (via drill 0.38)
  Top 0.152: v72.37,83.72 75.03,81.05 R9.1 | v69.93,105.13 69.93,110.01 68.63,111.31 68.63,112.07 U1.15
  Bottom 0.152: v72.37,83.72 72.37,86.92 69.93,89.36 v69.93,105.13
N$27
  Top 0.152: R11.1 95,113.59 92.26,113.59 85.32,120.53 D9.A
N$28
  Top 0.152: R5.1 70.84,81.21 70.84,72.29 77.4,65.74 77.4,64.37 D6.A
N$29
  Top 0.457: D4.A 91.04,157.1 91.04,155.27 89.59,153.83 U$6.V- 89.66,153.6 89.66,141.02 Q4.3D
N$30
  Top 0.457: D2.A 94.39,28.93 94.39,31.52 95.15,32.29 U$4.V- 95.3,32.51 95.3,48.59 Q2.3D
N$31
  Top 0.457: R2.2 121.44,95.08 125.71,95.08 125.94,95.3 R4.2 126.16,95.38 128.3,95.38 C7.1 128.53,95.3 132.26,95.3 Q3.1G
N$32
  Bottom 0.152: U$3.4 114.96,92.18 118.09,92.18 C16.1
N$33
  Top 0.457: C3.1 62.23,90.81 59.03,90.81 R3.2 58.8,90.96 55.68,90.96 Q1.1G 55.6,91.19 55.15,90.73 55.15,88.9 R7.2
N$34
  Top 0.457: R17.2 95.99,61.24 95.99,59.18 93.63,56.82 R16.2 93.55,56.59 93.55,56.37 95.84,54.08 C5.1 95.91,53.85 96.29,53.47 96.29,51.18 Q2.1G
PB5  (via drill 0.38)
  Top 0.152: v58.88,88.9 57.05,88.9 R7.1 | v69.01,99.04 69.55,99.04 72.06,101.55 72.06,102.31 U1.41
  Bottom 0.152: v58.88,88.9 v69.01,99.04 68.94,99.04 64.9,103.08 64.9,107.19 80.06,122.35 89.44,122.35 90.27,121.52 123.12,121.52 124.18,120.45 124.18,117.1 123.12,116.03 123.12,114.96 J3.6
PE3  (via drill 0.38)
  Top 0.152: J3.4 123.12,109.93 124.18,111 124.18,112.83 123.5,113.52 122.96,113.52 121.97,114.51 121.97,116.18 112.07,126.09 89.21,126.09 R15.1 89.21,126.01 v89.21,121.67 | v78.08,103.53 76.79,103.53 U1.49
  Bottom 0.152: v78.08,103.53 78.08,110.54 v89.21,121.67
PE4  (via drill 0.38)
  Top 0.152: 94.08,82.65 94.08,84.86 78.77,100.18 78.77,103.76 78.31,104.22 77.7,104.22 77.55,104.07 76.79,104.07 U1.50 | 94.08,82.65 94.08,61.32 R17.1 | 94.08,82.65 v108.18,82.65
  Bottom 0.152: v108.18,82.65 108.56,82.65 109.17,83.26 109.17,83.42 112.6,86.85 113.74,86.85 114.2,87.3 114.2,88.37 114.13,88.45 114.13,92.48 117.55,95.91 117.55,100.79 123.04,106.28 123.04,107.27 J3.3
PE5
  Top 0.152: J3.5 123.04,112.37 121.97,111.31 121.97,109.48 122.66,108.79 123.12,108.79 124.18,107.72 124.18,101.4 119.54,96.75 119.54,95.08 R2.1 119.46,95 116.03,91.57 106.51,91.57 103.23,88.29 92.41,88.29 89.59,91.11 89.59,92.33 80.9,101.02 80.9,102.09 78.46,104.52 76.79,104.52 U1.51
RESET
  Top 0.152: R1.2 67.8,83.11 67.8,95.38 60.48,102.7 60.48,105.82 67.87,113.21 69.85,113.21 70.08,112.98 70.08,112.14 U1.12
RFANT
  Top 0.457: B1.1 71.07,117.48 71.07,117.63 71.22,117.78 71.22,118.01 72.22,119 72.22,119.23 U$1.FEED 72.06,119.31 70.39,119.31 69.93,119.76 66.58,119.76 C19.2
SCL  (via drill 0.38)
  Top 0.152: v94.69,95.84 94.08,96.45 94.08,96.9 R8.1 | v93.93,94.77 93.47,94.77 93.25,94.54 U2.SCL/SPC | v65.59,106.96 66.96,106.96 U1.25 | v116.26,102.24 123.04,102.24 J3.1
  Bottom 0.152: v65.59,106.96 71.99,106.96 83.34,95.61 93.17,95.61 93.93,94.85 v93.93,94.77 94.69,95.53 v94.69,95.84 101.09,102.24 v116.26,102.24
SDA  (via drill 0.38)
  Top 0.152: v91.19,94.92 91.72,95.46 92.1,95.46 92.33,95.23 92.33,94.54 U2.SDA/SDI/SDO | v65.59,105.9 66.2,106.51 66.96,106.51 U1.26 | v100.26,99.19 105.82,104.75 123.04,104.75 J3.2
  Bottom 0.152: v65.59,105.9 70.08,105.9 81.05,94.92 v91.19,94.92 92.03,94.08 94.16,94.08 99.27,99.19 v100.26,99.19
VBAT  (via drill 0.38)
  Top 0.457: D3.C 155.81,91.04 151.62,91.04 151.23,91.42 U$5.V+ 151.01,91.34 150.4,90.73 145.9,90.73 C6.1 145.67,90.73 143.92,90.73 137.82,96.83 127.76,96.83 125.25,99.34 125.25,117.94 123.27,119.92 J3.8 123.12,120.07 124.34,121.29 124.34,123.04 123.57,123.8 122.66,123.8 119.92,126.55 98.05,126.55 96.83,127.76 96.83,143.54 94.54,145.82 94.54,148.95 C8.1 94.54,149.25 94.54,151.77 92.71,153.6 U$6.V+ 92.56,153.83 94.39,155.65 94.39,157.1 D4.C | R11.2 96.98,113.59 106.81,113.59 109.4,116.18 R10.1 109.63,116.33 113.29,119.99 v117.25,119.99 | D1.C 32.29,95.08 33.12,95.08 35.72,92.48 U$2.V+ 35.94,92.56 37.93,94.54 41.13,94.54 C2.1 41.35,94.47 v42.88,94.47 | D2.C 91.04,28.93 91.04,31.22 92.1,32.29 U$4.V+ 92.03,32.51 90.81,33.73 90.81,37.93 C4.1 90.81,38.15 v90.81,39.68
  Bottom 0.457: J3.8 123.04,119.99 v117.25,119.99 117.1,119.84 117.1,96.14 113.36,92.41 113.36,90.73 112.91,90.27 112.6,90.27 U$3.1 112.37,90.2 112.37,88.75 112.52,88.6 | 112.52,88.6 113.21,87.91 C10.1 | 112.52,88.6 108.11,84.18 J2.1 107.88,84.03 91.49,67.64 | v90.81,39.68 90.81,66.96 91.49,67.64 | v42.88,94.47 52.17,94.47 63.76,82.88 76.25,82.88 91.49,67.64
  pour Route2 (rank 2): 56.96,97.86 29.36,97.96 29.56,87.86 57.46,87.86 57.46,57.56 87.96,57.56 87.96,26.56 97.06,26.56 97.06,57.66 127.56,57.66 127.56,88.06 157.26,88.06 157.26,97.36 127.76,97.36 127.76,127.76 97.16,127.76 97.16,162.86 87.56,162.86 87.86,125.56 124.86,125.36 124.86,124.86 124.56,124.86 124.56,60.06 61.26,60.06 61.26,99.46 57.16,99.46

### Text on the board
tPlace: 10 | 9 | 8 | 7 | 6 | 5 | 4 | 3 | 2 | 1